# EAGLE schematic main-unit-psu (EAGLE 9.6.2)
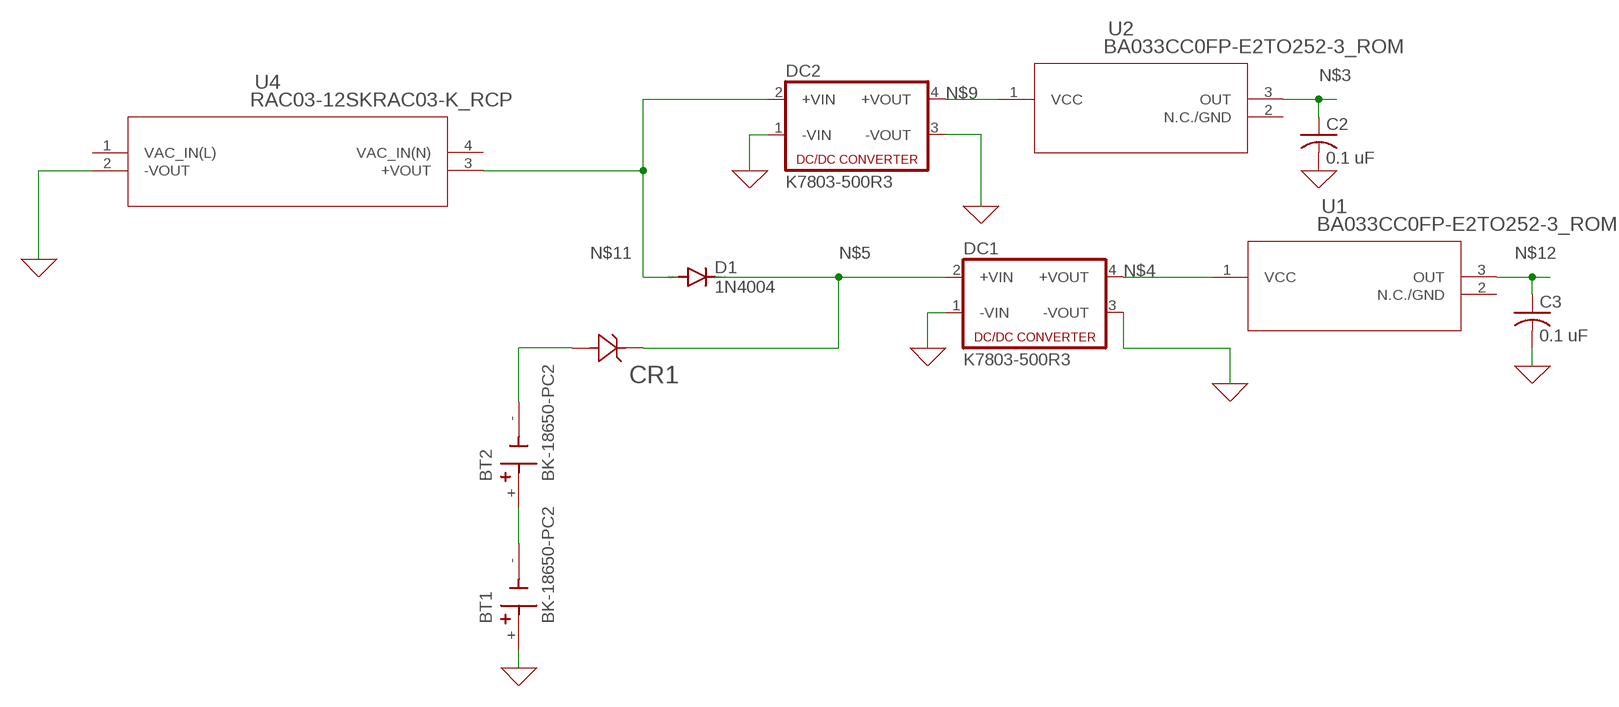
[diagram p0: schematic, sheet 1]

## Parts
BT1  BK-18650-PC2  [BAT_BK-18650-PC2]
BT2  BK-18650-PC2  [BAT_BK-18650-PC2]
C2  0.1 uF  C-US050-024X044  [C050-024X044]
C3  0.1 uF  C-US050-024X044  [C050-024X044]
CR1  1N5819DO-41_STM  [DO-41_STM]
D1  1N4004  [DO41-10]
DC1  K7803-500R3  NME  [NME]
DC2  K7803-500R3  NME  [NME]
U1  BA033CC0FP-E2TO252-3_ROM  [TO252-3_ROM]
U2  BA033CC0FP-E2TO252-3_ROM  [TO252-3_ROM]
U4  RAC03-12SKRAC03-K_RCP  [RAC03-K_RCP]

## Nets
0: BT1.+ C2.2 C3.2 DC1.1(-VIN) DC1.3(-VOUT) DC2.1(-VIN) DC2.3(-VOUT) U4.2(-VOUT) ; supply symbol labelled GND
N$3: C2.1 U2.3(OUT)
N$4: DC1.4(+VOUT) U1.1(VCC)
N$5: CR1.1 D1.C DC1.2(+VIN)
N$6: BT1.- BT2.+
N$7: BT2.- CR1.2
N$9: DC2.4(+VOUT) U2.1(VCC)
N$11: D1.A DC2.2(+VIN) U4.3(+VOUT)
N$12: C3.1 U1.3(OUT)
Unconnected: U1.2(N.C./GND) U2.2(N.C./GND)

## Power pins joined to a net without a drawn wire
VAC_IN(L): U4.1(VAC_IN(L))
VAC_IN(N): U4.4(VAC_IN(N))

## Library data of the parts
BT1 BT2 = BK-18650-PC2:BK-18650-PC2: Battery Holder (Open) 18650 1 Cell PC Pin Check availability <https://pricing.snapeda.com/parts/BK-18650-PC2/MPD%20%28Memory%20Protection%20Devices%29/view-part?ref=eda>; AVAILABILITY: In Stock; DESCRIPTION: Battery Holder (Open) 18650 1 Cell PC Pin; MF: MPD (Memory Protection Devices); MP: BK-18650-PC2; PACKAGE: None; PRICE: None; PURCHASE-URL: https://pricing.snapeda.com/search/part/BK-18650-PC2/?ref=eda
C2 C3 = rcl:C-US: CAPACITOR, American symbol; SPICEPREFIX: C
CR1 = 2023-04-06_19-32-50_Library:1N5819; COPYRIGHT: Copyright (C) 2023 Ultra Librarian. All rights reserved.; DIGI-KEY_PART_NUMBER_1: 1N5819FSCT-ND; DIGI-KEY_PART_NUMBER_2: 1N5819FSTR-ND; DIGI-KEY_PART_NUMBER_3: 2156-1N5819-ND; DIGI-KEY_PART_NUMBER_4: 2368-1N5819-ND; DIGI-KEY_PART_NUMBER_5: 2796-1N5819TR-ND; DIGI-KEY_PART_NUMBER_6: 497-6610-1-ND; DIGI-KEY_PART_NUMBER_7: 497-6610-3-ND; MANUFACTURER_PART_NUMBER: 1N5819; MFR_NAME: STMicroelectronics
D1 = diode:1N4004: DIODE general purpose rectifier, 1 A
DC1 DC2 = dc-dc-converter:NME: DC-DC CONVERTER; MF: C & D TECHNOLOGIES, INC; MPN: NME1205D; OC_FARNELL: 1021466; OC_NEWARK: 98B8198
U1 U2 = 2023-03-08_12-17-23_Library:BA033CC0FP-E2; COPYRIGHT: Copyright (C) 2023 Ultra Librarian. All rights reserved.; DIGI-KEY_PART_NUMBER_1: BA033CC0FP-E2TR-ND; DIGI-KEY_PART_NUMBER_2: BA033CC0FP-E2CT-ND; DIGI-KEY_PART_NUMBER_3: BA033CC0FP-E2DKR-ND; MANUFACTURER_PART_NUMBER: BA033CC0FP-E2; MFR_NAME: ROHM Semiconductor
U4 = 2023-04-05_11-47-46_Library:RAC03-12SK; COPYRIGHT: Copyright (C) 2023 Ultra Librarian. All rights reserved.; DIGI-KEY_PART_NUMBER_1: 945-3442-ND; MANUFACTURER_PART_NUMBER: RAC03-12SK; MFR_NAME: Recom Power